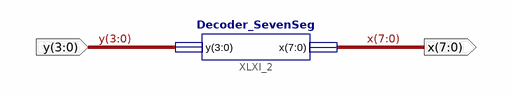
[diagram p0: schematic sheet 1]
// Xilinx ISE schematic scheme.sch (spartan6) as structural Verilog: 1 symbols, 2 ports
module scheme (
  input  [3:0] y,
  output [7:0] x
);

  Decoder_SevenSeg XLXI_2 (.y(y), .x(x));
endmodule
